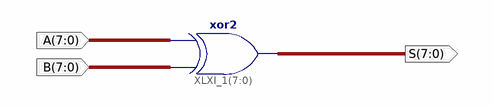
[diagram p0: schematic sheet 1]
// Xilinx ISE schematic ExOr.sch (spartan6) as structural Verilog: 1 symbols, 3 ports
module ExOr (
  input  [7:0] A,
  input  [7:0] B,
  output [7:0] S
);

  assign S = B ^ A;  // xor2 XLXI_1[7..0], 8 bits wide
endmodule
